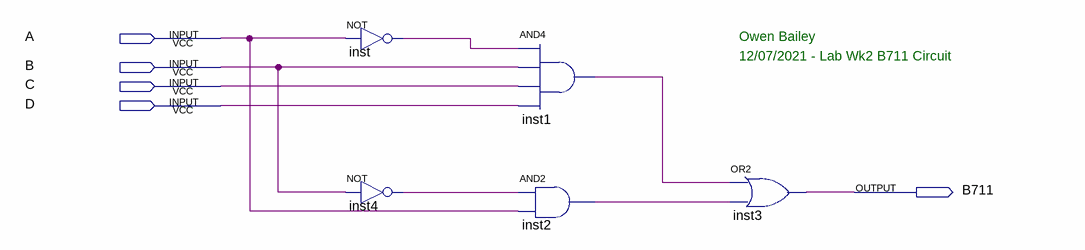
[diagram p0: schematic sheet]
// Quartus schematic introduction.bdf as structural Verilog: 5 symbols, 5 pins
module introduction (
  input  A,
  input  B,
  input  C,
  input  D,
  output B711
);

  wire inst1_out, inst2_out, inst4_out, inst_out;

  not inst (inst_out, A);
  not inst4 (inst4_out, B);
  and inst1 (inst1_out, inst_out, B, C, D);
  and inst2 (inst2_out, inst4_out, A);
  or inst3 (B711, inst1_out, inst2_out);

  // Notes on the sheet:
  //   Owen Bailey
  //   12/07/2021 - Lab Wk2 B711 Circuit
endmodule
